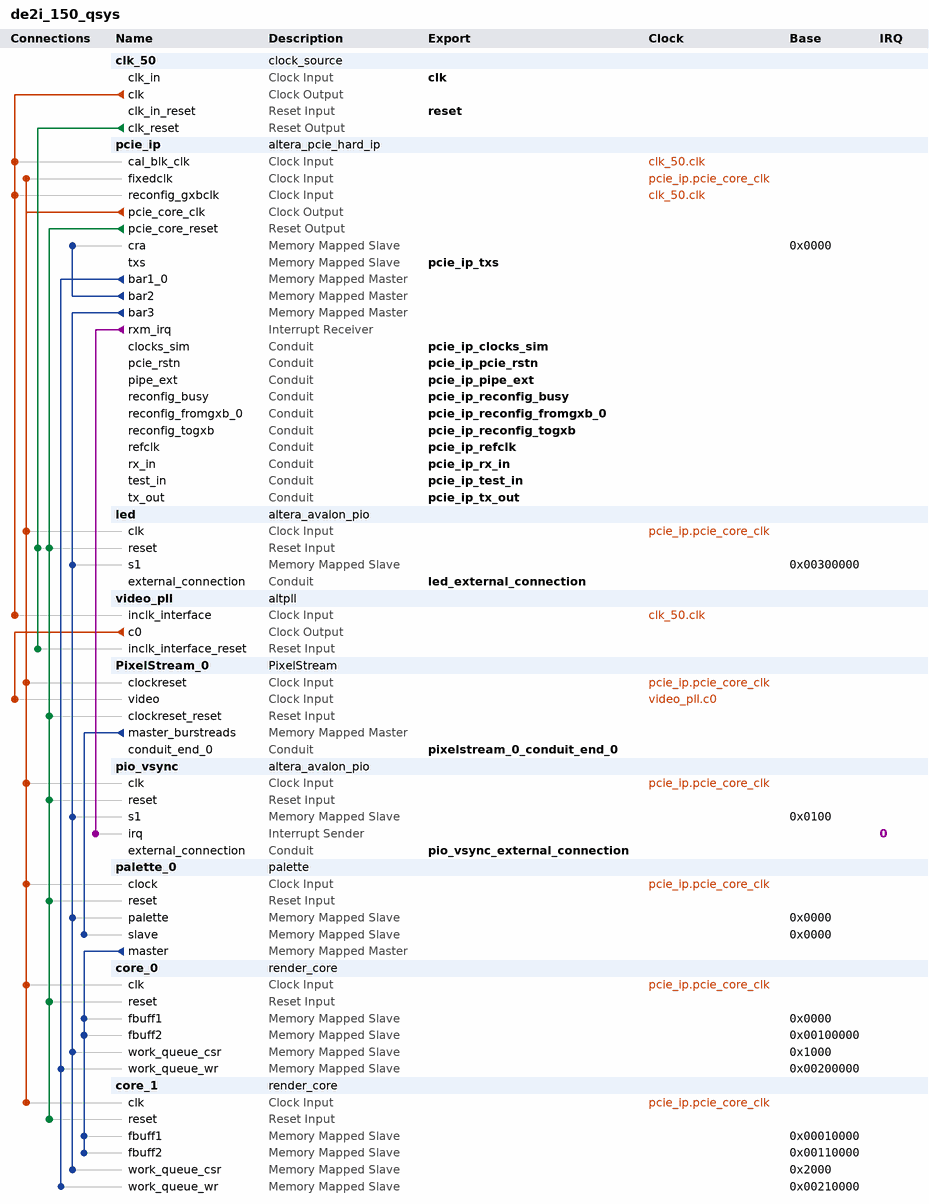
[diagram p0: system contents]
# Platform Designer (Qsys) system de2i_150_qsys, Cyclone IV GX EP4CGX150DF31C7
# Parameters at their usual value, and those the tool derives, are not listed.
package require -exact qsys 16.1
create_system de2i_150_qsys
set_project_property DEVICE_FAMILY {Cyclone IV GX}
set_project_property DEVICE EP4CGX150DF31C7

add_instance clk_50 clock_source 16.1
set_instance_parameter_value clk_50 clockFrequency 50000000

add_instance pcie_ip altera_pcie_hard_ip 16.1
set_instance_parameter_value pcie_ip {BAR Type} {64 bit Prefetchable,Not used,32 bit Non-Prefetchable,32 bit Non-Prefetchable,Not used,Not used}
set_instance_parameter_value pcie_ip CB_A2P_ADDR_MAP_PASS_THRU_BITS 31
set_instance_parameter_value pcie_ip CG_ENABLE_A2P_INTERRUPT 0
set_instance_parameter_value pcie_ip CG_NO_CPL_REORDERING 0
set_instance_parameter_value pcie_ip {PCIe Address 31:0} 0x00000000,0x00000000,0x00000000,0x00000000,0x00000000,0x00000000,0x00000000,0x00000000,0x00000000,0x00000000,0x00000000,0x00000000,0x00000000,0x00000000,0x00000000,0x00000000
set_instance_parameter_value pcie_ip {PCIe Address 63:32} 0x00000000,0x00000000,0x00000000,0x00000000,0x00000000,0x00000000,0x00000000,0x00000000,0x00000000,0x00000000,0x00000000,0x00000000,0x00000000,0x00000000,0x00000000,0x00000000
set_instance_parameter_value pcie_ip class_code 0
set_instance_parameter_value pcie_ip device_id 57345
set_instance_parameter_value pcie_ip my_advanced_errors false
set_instance_parameter_value pcie_ip my_enable_ecrc_check false
set_instance_parameter_value pcie_ip my_enable_ecrc_gen false
set_instance_parameter_value pcie_ip p_pcie_app_clk 1
set_instance_parameter_value pcie_ip p_pcie_test_out_width None
set_instance_parameter_value pcie_ip p_user_msi_enable 0
set_instance_parameter_value pcie_ip subsystem_device_id 4
set_instance_parameter_value pcie_ip subsystem_vendor_id 4466
set_instance_parameter_value pcie_ip vendor_id 4466

add_instance led altera_avalon_pio 16.1
set_instance_parameter_value led direction Output
set_instance_parameter_value led width 4

add_instance video_pll altpll 16.1
set_instance_parameter_value video_pll CLK0_DIVIDE_BY 100
set_instance_parameter_value video_pll CLK0_MULTIPLY_BY 9
set_instance_parameter_value video_pll INCLK0_INPUT_FREQUENCY 10000
set_instance_parameter_value video_pll PORT_ARESET PORT_USED
set_instance_parameter_value video_pll PORT_LOCKED PORT_UNUSED
set_instance_parameter_value video_pll PORT_clk1 PORT_UNUSED
set_instance_parameter_value video_pll PORT_clk2 PORT_UNUSED
set_instance_parameter_value video_pll PORT_clk3 PORT_UNUSED

add_instance PixelStream_0 PixelStream 1.0

add_instance pio_vsync altera_avalon_pio 16.1
set_instance_parameter_value pio_vsync captureEdge true
set_instance_parameter_value pio_vsync direction Input
set_instance_parameter_value pio_vsync edgeType FALLING
set_instance_parameter_value pio_vsync generateIRQ true
set_instance_parameter_value pio_vsync irqType EDGE
set_instance_parameter_value pio_vsync width 1

add_instance palette_0 palette 1.0

add_instance core_0 render_core 1.0
set_instance_parameter_value core_0 core_id 0

add_instance core_1 render_core 1.0
set_instance_parameter_value core_1 core_id 1

# connections
add_connection clk_50.clk pcie_ip.cal_blk_clk clock
add_connection clk_50.clk pcie_ip.reconfig_gxbclk clock
add_connection clk_50.clk video_pll.inclk_interface clock
add_connection pcie_ip.pcie_core_clk core_0.clk clock
add_connection pcie_ip.pcie_core_clk core_1.clk clock
add_connection pcie_ip.pcie_core_clk led.clk clock
add_connection pcie_ip.pcie_core_clk palette_0.clock clock
add_connection pcie_ip.pcie_core_clk pcie_ip.fixedclk clock
add_connection pcie_ip.pcie_core_clk pio_vsync.clk clock
add_connection pcie_ip.pcie_core_clk PixelStream_0.clockreset clock
add_connection video_pll.c0 PixelStream_0.video clock
add_connection clk_50.clk_reset led.reset reset
add_connection clk_50.clk_reset video_pll.inclk_interface_reset reset
add_connection pcie_ip.pcie_core_reset core_0.reset reset
add_connection pcie_ip.pcie_core_reset core_1.reset reset
add_connection pcie_ip.pcie_core_reset led.reset reset
add_connection pcie_ip.pcie_core_reset palette_0.reset reset
add_connection pcie_ip.pcie_core_reset pio_vsync.reset reset
add_connection pcie_ip.pcie_core_reset PixelStream_0.clockreset_reset reset
add_connection palette_0.master core_0.fbuff1 avalon
set_connection_parameter_value palette_0.master/core_0.fbuff1 baseAddress 0x0000
add_connection palette_0.master core_0.fbuff2 avalon
set_connection_parameter_value palette_0.master/core_0.fbuff2 baseAddress 0x00100000
add_connection palette_0.master core_1.fbuff1 avalon
set_connection_parameter_value palette_0.master/core_1.fbuff1 baseAddress 0x00010000
add_connection palette_0.master core_1.fbuff2 avalon
set_connection_parameter_value palette_0.master/core_1.fbuff2 baseAddress 0x00110000
add_connection pcie_ip.bar1_0 core_0.work_queue_wr avalon
set_connection_parameter_value pcie_ip.bar1_0/core_0.work_queue_wr baseAddress 0x00200000
add_connection pcie_ip.bar1_0 core_1.work_queue_wr avalon
set_connection_parameter_value pcie_ip.bar1_0/core_1.work_queue_wr baseAddress 0x00210000
add_connection pcie_ip.bar2 pcie_ip.cra avalon
set_connection_parameter_value pcie_ip.bar2/pcie_ip.cra baseAddress 0x0000
add_connection pcie_ip.bar3 core_0.work_queue_csr avalon
set_connection_parameter_value pcie_ip.bar3/core_0.work_queue_csr baseAddress 0x1000
add_connection pcie_ip.bar3 core_1.work_queue_csr avalon
set_connection_parameter_value pcie_ip.bar3/core_1.work_queue_csr baseAddress 0x2000
add_connection pcie_ip.bar3 led.s1 avalon
set_connection_parameter_value pcie_ip.bar3/led.s1 baseAddress 0x00300000
add_connection pcie_ip.bar3 palette_0.palette avalon
set_connection_parameter_value pcie_ip.bar3/palette_0.palette baseAddress 0x0000
add_connection pcie_ip.bar3 pio_vsync.s1 avalon
set_connection_parameter_value pcie_ip.bar3/pio_vsync.s1 baseAddress 0x0100
add_connection PixelStream_0.master_burstreads palette_0.slave avalon
set_connection_parameter_value PixelStream_0.master_burstreads/palette_0.slave baseAddress 0x0000
add_connection pcie_ip.rxm_irq pio_vsync.irq interrupt
set_connection_parameter_value pcie_ip.rxm_irq/pio_vsync.irq irqNumber 0

# exported interfaces
add_interface clk clock sink
set_interface_property clk EXPORT_OF clk_50.clk_in
add_interface led_external_connection conduit end
set_interface_property led_external_connection EXPORT_OF led.external_connection
add_interface pcie_ip_clocks_sim conduit end
set_interface_property pcie_ip_clocks_sim EXPORT_OF pcie_ip.clocks_sim
add_interface pcie_ip_pcie_rstn conduit end
set_interface_property pcie_ip_pcie_rstn EXPORT_OF pcie_ip.pcie_rstn
add_interface pcie_ip_pipe_ext conduit end
set_interface_property pcie_ip_pipe_ext EXPORT_OF pcie_ip.pipe_ext
add_interface pcie_ip_reconfig_busy conduit end
set_interface_property pcie_ip_reconfig_busy EXPORT_OF pcie_ip.reconfig_busy
add_interface pcie_ip_reconfig_fromgxb_0 conduit end
set_interface_property pcie_ip_reconfig_fromgxb_0 EXPORT_OF pcie_ip.reconfig_fromgxb_0
add_interface pcie_ip_reconfig_togxb conduit end
set_interface_property pcie_ip_reconfig_togxb EXPORT_OF pcie_ip.reconfig_togxb
add_interface pcie_ip_refclk conduit end
set_interface_property pcie_ip_refclk EXPORT_OF pcie_ip.refclk
add_interface pcie_ip_rx_in conduit end
set_interface_property pcie_ip_rx_in EXPORT_OF pcie_ip.rx_in
add_interface pcie_ip_test_in conduit end
set_interface_property pcie_ip_test_in EXPORT_OF pcie_ip.test_in
add_interface pcie_ip_tx_out conduit end
set_interface_property pcie_ip_tx_out EXPORT_OF pcie_ip.tx_out
add_interface pcie_ip_txs avalon slave
set_interface_property pcie_ip_txs EXPORT_OF pcie_ip.txs
add_interface pio_vsync_external_connection conduit end
set_interface_property pio_vsync_external_connection EXPORT_OF pio_vsync.external_connection
add_interface pixelstream_0_conduit_end_0 conduit end
set_interface_property pixelstream_0_conduit_end_0 EXPORT_OF PixelStream_0.conduit_end_0
add_interface reset reset sink
set_interface_property reset EXPORT_OF clk_50.clk_in_reset

set_interconnect_requirement {$system} qsys_mm.clockCrossingAdapter HANDSHAKE
set_interconnect_requirement {$system} qsys_mm.maxAdditionalLatency 1

save_system de2i_150_qsys.qsys
